# EAGLE design BreakoutShieldRevB (EAGLE 7.5.0)
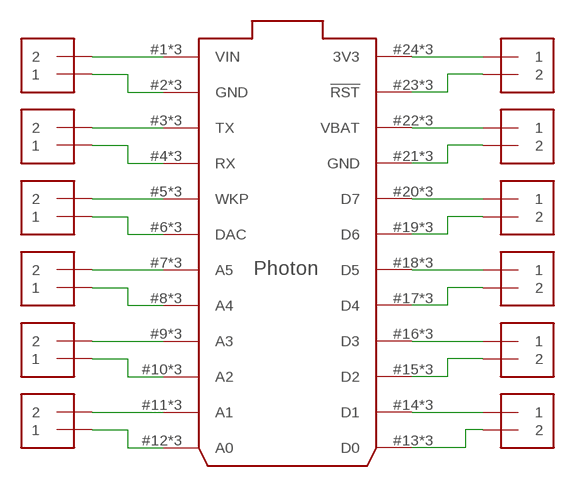
[diagram p0: schematic, sheet 1]

## Parts
J1  1X2-3.5MM  [1X2-3.5MM]
J2  1X2-3.5MM  [1X2-3.5MM]
J3  1X2-3.5MM  [1X2-3.5MM]
J4  1X2-3.5MM  [1X2-3.5MM]
J5  1X2-3.5MM  [1X2-3.5MM]
J6  1X2-3.5MM  [1X2-3.5MM]
J7  1X2-3.5MM  [1X2-3.5MM]
J8  1X2-3.5MM  [1X2-3.5MM]
J9  1X2-3.5MM  [1X2-3.5MM]
J10  1X2-3.5MM  [1X2-3.5MM]
J11  1X2-3.5MM  [1X2-3.5MM]
J12  1X2-3.5MM  [1X2-3.5MM]
U$1  PHOTON_WITH_STACKABLE_HEADERS  [PHOTON_STACKABLE]

## Nets
N$1: J1.2 U$1.1(VIN) U$1.#1(VIN) U$1.@1(VIN)
N$2: J1.1 U$1.2(GND) U$1.#2(GND) U$1.@2(GND)
N$3: J2.2 U$1.3(TX) U$1.#3(TX) U$1.@3(TX)
N$4: J2.1 U$1.4(RX) U$1.#4(RX) U$1.@4(RX)
N$5: J3.2 U$1.5(WKP) U$1.#5(WKP) U$1.@5(WKP)
N$6: J3.1 U$1.6(DAC) U$1.#6(DAC) U$1.@6(DAC)
N$7: J4.2 U$1.7(A5) U$1.#7(A5) U$1.@7(A5)
N$8: J4.1 U$1.8(A4) U$1.#8(A4) U$1.@8(A4)
N$9: J5.2 U$1.9(A3) U$1.#9(A3) U$1.@9(A3)
N$10: J5.1 U$1.10(A2) U$1.#10(A2) U$1.@10(A2)
N$11: J6.2 U$1.11(A1) U$1.#11(A1) U$1.@11(A1)
N$12: J6.1 U$1.12(A0) U$1.#12(A0) U$1.@12(A0)
N$13: J7.1 U$1.24(3V3) U$1.#24(3V3) U$1.@24(3V3)
N$14: J7.2 U$1.23(!RST) U$1.#23(!RST) U$1.@23(!RST)
N$15: J8.1 U$1.22(VBAT) U$1.#22(VBAT) U$1.@22(VBAT)
N$16: J8.2 U$1.21(GND) U$1.#21(GND) U$1.@21(GND)
N$17: J9.1 U$1.20(D7) U$1.#20(D7) U$1.@20(D7)
N$18: J9.2 U$1.19(D6) U$1.#19(D6) U$1.@19(D6)
N$19: J10.1 U$1.18(D5) U$1.#18(D5) U$1.@18(D5)
N$20: J10.2 U$1.17(D4) U$1.#17(D4) U$1.@17(D4)
N$21: J11.1 U$1.16(D3) U$1.#16(D3) U$1.@16(D3)
N$22: J11.2 U$1.15(D2) U$1.#15(D2) U$1.@15(D2)
N$23: J12.1 U$1.14(D1) U$1.#14(D1) U$1.@14(D1)
N$24: J12.2 U$1.13(D0) U$1.#13(D0) U$1.@13(D0)

## Library data of the parts
J1-J12 = adafruit:1X2: 3.5mm Terminal block http://www.ladyada.net/library/pcb/eaglelibrary.html
U$1 = Spark:PHOTON

## Board
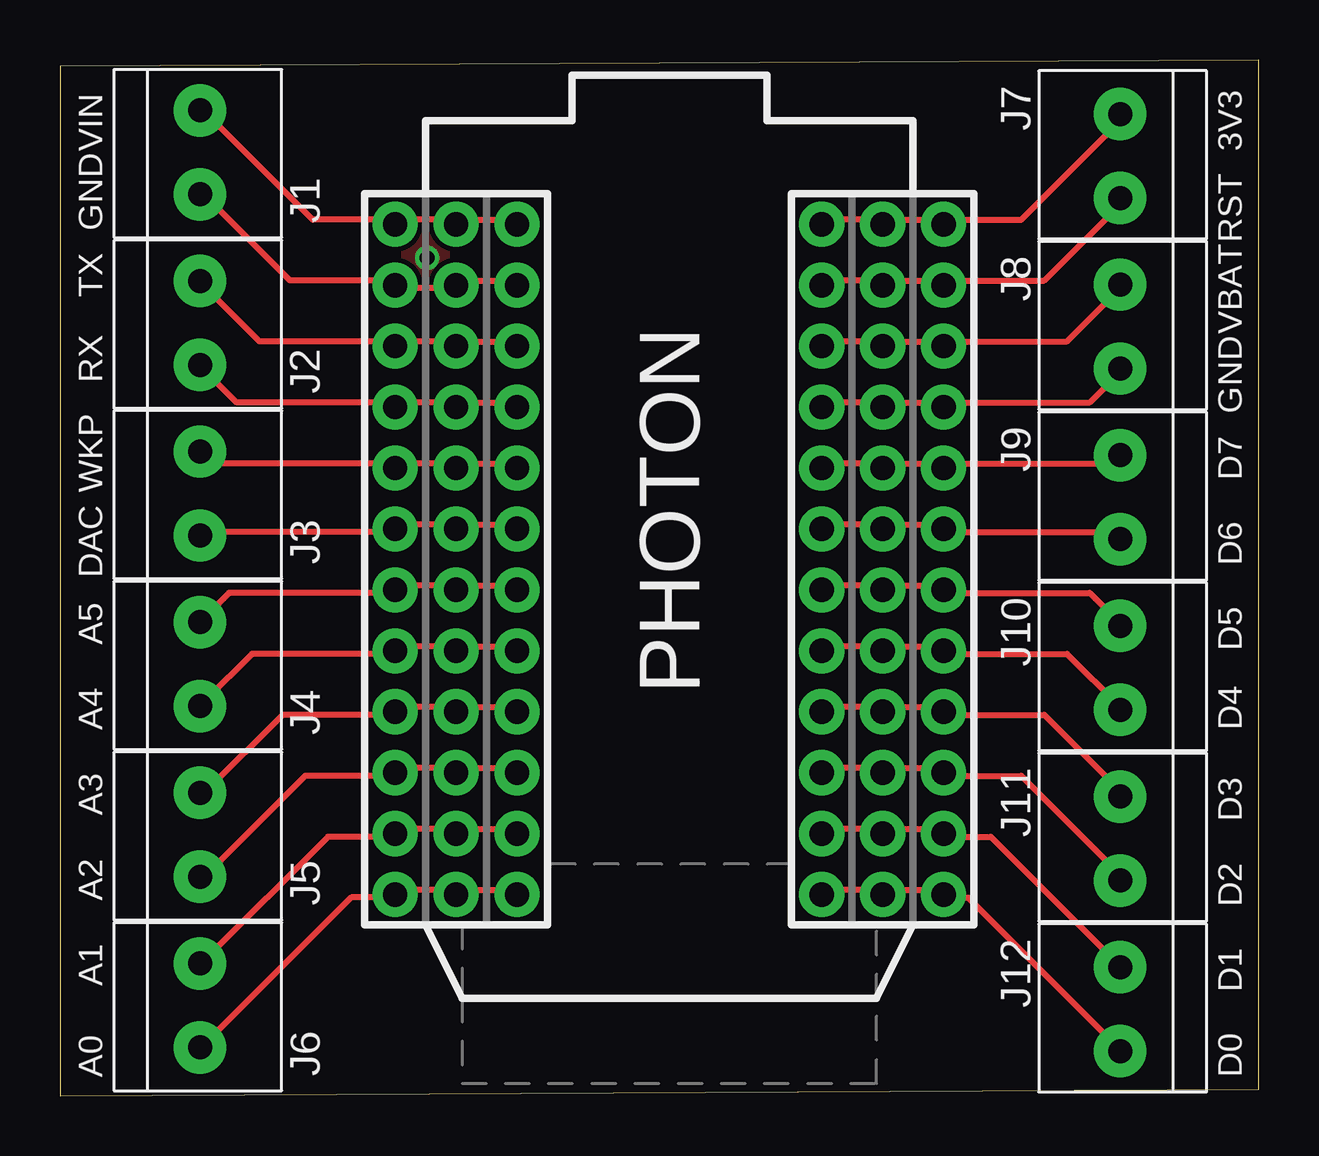
[diagram p1: board, top side]
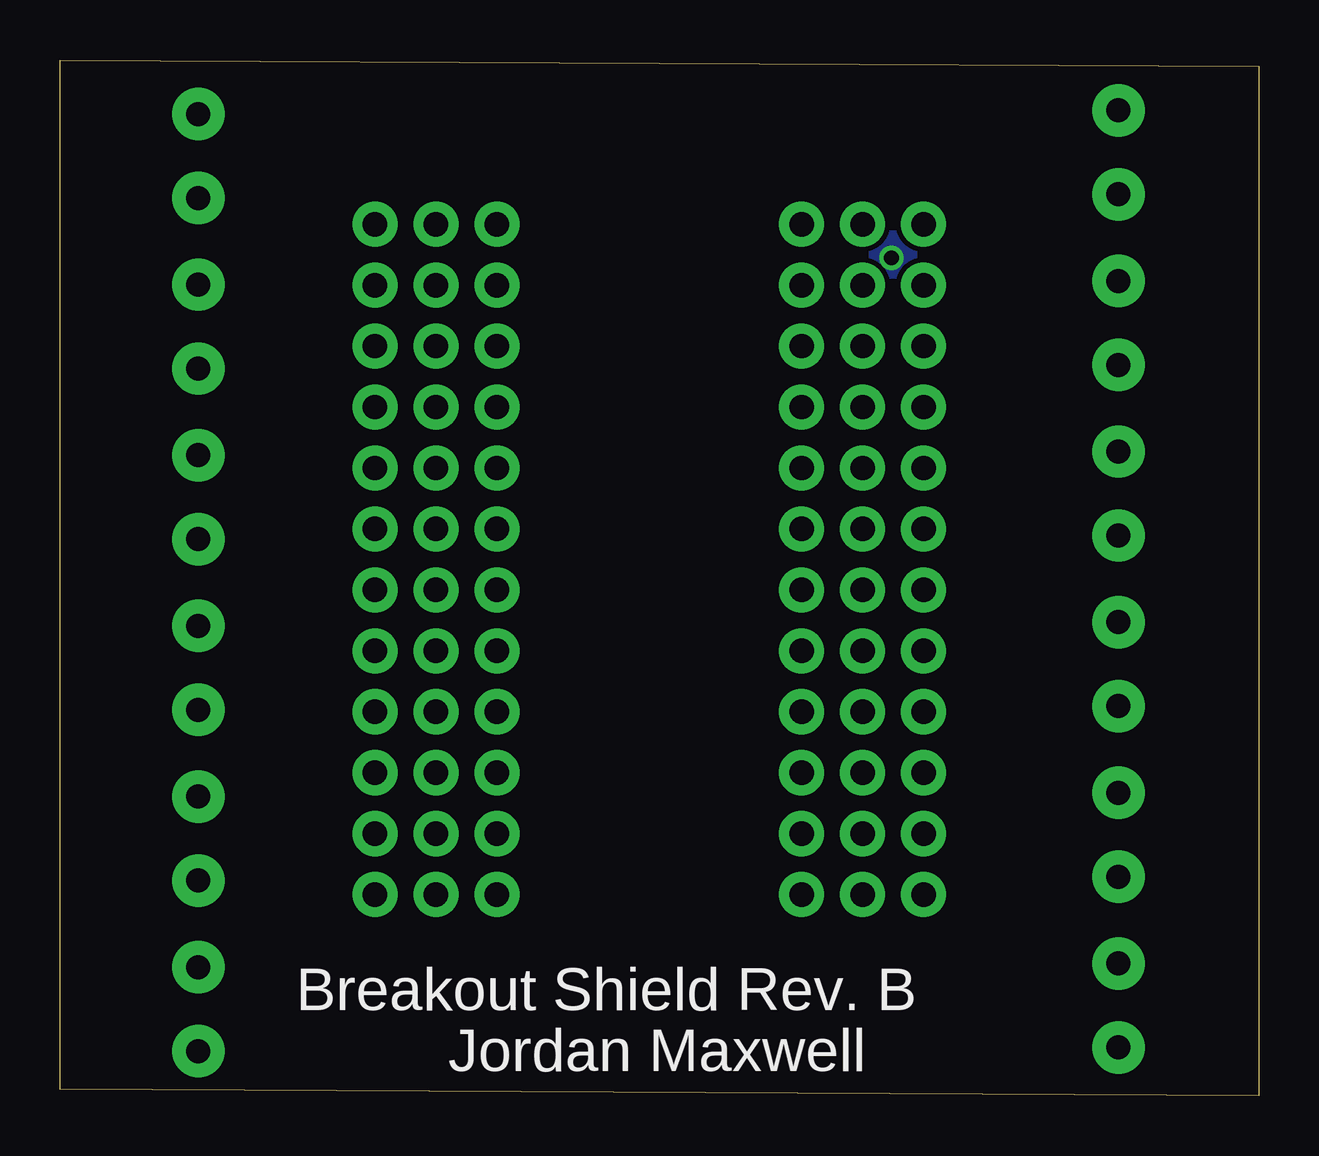
[diagram p2: board, bottom side, seen from below]

Size 49.96 x 43.17 mm. Coordinates in mm from the lower left corner, seen from the top.
Outline: 0,0 49.96,0.25 49.96,43.17 0,42.92 0,0
Copper layers (1*16): Top 0.035mm / dielectric 1.5mm / Bottom 0.035mm
Design rules "default": minimum track width 10mil, minimum drill 24mil, track to track 8mil, track to pad 8mil, pad to pad 8mil, via to via 8mil, smd to smd 8mil, copper to edge 40mil, drill to drill 8mil, minimum pad ring 10mil, minimum via ring 8mil, stop-mask expansion 4mil, vias tented up to drill 0mil, thermal gap 10mil

### Footprints (pad centres in the part's own frame; a part is rotated, then mirrored left to right if it is on the bottom)
1X2-3.5MM = drill 1 pad 2.184: 1 1.8,0; 2 -1.7,0
PHOTON_STACKABLE = drill 1.016 pad 1.88: 1 1.27,32.258; 2 1.27,29.718; 3 1.27,27.178; 4 1.27,24.638; 5 1.27,22.098; 6 1.27,19.558; 7 1.27,17.018; 8 1.27,14.478; 9 1.27,11.938; 10 1.27,9.398; 11 1.27,6.858; 12 1.27,4.318; 13 19.05,4.318; 14 19.05,6.858; 15 19.05,9.398; 16 19.05,11.938; 17 19.05,14.478; 18 19.05,17.018; 19 19.05,19.558; 20 19.05,22.098; 21 19.05,24.638; 22 19.05,27.178; 23 19.05,29.718; 24 19.05,32.258; #1 3.81,32.258; #2 3.81,29.718; #3 3.81,27.178; #4 3.81,24.638; #5 3.81,22.098; #6 3.81,19.558; #7 3.81,17.018; #8 3.81,14.478; #9 3.81,11.938; #10 3.81,9.398; #11 3.81,6.858; #12 3.81,4.318; #13 21.59,4.318; #14 21.59,6.858; #15 21.59,9.398; #16 21.59,11.938; #17 21.59,14.478; #18 21.59,17.018; #19 21.59,19.558; #20 21.59,22.098; #21 21.59,24.638; #22 21.59,27.178; #23 21.59,29.718; #24 21.59,32.258; @1 -1.27,32.258; @2 -1.27,29.718; @3 -1.27,27.178; @4 -1.27,24.638; @5 -1.27,22.098; @6 -1.27,19.558; @7 -1.27,17.018; @8 -1.27,14.478; @9 -1.27,11.938; @10 -1.27,9.398; @11 -1.27,6.858; @12 -1.27,4.318; @13 16.51,4.318; @14 16.51,6.858; @15 16.51,9.398; @16 16.51,11.938; @17 16.51,14.478; @18 16.51,17.018; @19 16.51,19.558; @20 16.51,22.098; @21 16.51,24.638; @22 16.51,27.178; @23 16.51,29.718; @24 16.51,32.258

### Placement (x,y rotation side)
J1  5.84,39.37 270 top
J2  5.84,32.26 270 top
J3  5.84,25.15 270 top
J4  5.84,18.03 270 top
J5  5.84,10.92 270 top
J6  5.84,3.81 270 top
J7  44.2,39.12 90 top
J8  44.2,32 90 top
J9  44.2,24.89 90 top
J10  44.2,17.78 90 top
J11  44.2,10.67 90 top
J12  44.2,3.56 90 top
U$1  15.24,4.06 0 top

### Tracks (layer width: path | path; a pad name or v marks a point on that pad's centre or on a via)
GND  (via drill 0.61)
  other vias: 15.3,34.93
  pour Bottom: 0,-0.25 50.04,0 50.04,42.93 0,42.67
  pour Top: 0,-0.25 50.04,0 50.04,42.93 0,42.67
N$1
  Top 0.254: U$1.#1 18.8,36.51 16.57,36.51 U$1.1 16.26,36.51 14.03,36.51 U$1.@1 13.72,36.51 10.54,36.51 6.1,40.96 J1.2
N$2
  Top 0.254: U$1.#2 18.8,33.97 16.57,33.97 U$1.2 16.26,33.66 14.03,33.66 U$1.@2 13.72,33.97 9.59,33.97 6.1,37.47 J1.1
N$3
  Top 0.254: U$1.#3 18.8,31.43 16.57,31.43 U$1.3 16.26,31.43 14.03,31.43 U$1.@3 13.72,31.43 8.32,31.43 6.1,33.66 J2.2
N$4
  Top 0.254: U$1.#4 18.8,28.89 16.57,28.89 U$1.4 16.26,28.89 14.03,28.89 U$1.@4 13.72,28.89 7.37,28.89 6.1,30.16 J2.1
N$5
  Top 0.254: U$1.#5 18.8,26.35 16.57,26.35 U$1.5 16.26,26.35 14.03,26.35 U$1.@5 13.72,26.35 6.41,26.35 6.1,26.67 J3.2
N$6
  Top 0.254: U$1.#6 18.8,23.81 16.57,23.81 U$1.6 16.26,23.81 14.03,23.81 U$1.@6 13.72,23.49 6.1,23.49 J3.1
N$7
  Top 0.254: U$1.#7 18.8,21.27 16.57,21.27 U$1.7 16.26,21.27 14.03,21.27 U$1.@7 13.72,20.95 7.05,20.95 6.1,20 J4.2
N$8
  Top 0.254: U$1.#8 18.8,18.73 16.57,18.73 U$1.8 16.26,18.73 14.03,18.73 U$1.@8 13.72,18.41 8,18.41 6.1,16.51 J4.1
N$9
  Top 0.254: U$1.#9 18.8,16.19 16.57,16.19 U$1.9 16.26,16.19 14.03,16.19 U$1.@9 13.72,15.88 9.27,15.88 6.1,12.7 J5.2
N$10
  Top 0.254: U$1.#10 18.8,13.65 16.57,13.65 U$1.10 16.26,13.65 14.03,13.65 U$1.@10 13.72,13.34 10.22,13.34 6.1,9.21 J5.1
N$11
  Top 0.254: U$1.#11 18.8,11.11 16.57,11.11 U$1.11 16.26,11.11 14.03,11.11 U$1.@11 13.72,10.79 11.18,10.79 6.1,5.71 J6.2
N$12
  Top 0.254: U$1.#12 18.8,8.57 16.57,8.57 U$1.12 16.26,8.57 14.03,8.57 U$1.@12 13.72,8.26 12.13,8.26 6.1,2.22 J6.1
N$13
  Top 0.254: U$1.@24 31.81,36.51 34.04,36.51 U$1.24 34.35,36.51 36.58,36.51 U$1.#24 36.89,36.51 40.07,36.51 44.2,40.64 J7.1
N$14
  Top 0.254: U$1.@23 31.81,33.97 34.04,33.97 U$1.23 34.35,33.97 36.58,33.97 U$1.#23 36.89,33.97 41.02,33.97 44.2,37.15 J7.2
N$15
  Top 0.254: U$1.@22 31.81,31.43 34.04,31.43 U$1.22 34.35,31.43 36.58,31.43 U$1.#22 36.89,31.43 41.97,31.43 44.2,33.66 J8.1
N$16
  Top 0.254: U$1.@21 31.81,28.89 34.04,28.89 U$1.21 34.35,28.89 36.58,28.89 U$1.#21 36.89,28.89 42.93,28.89 44.2,30.16 J8.2
N$17
  Top 0.254: U$1.@20 31.81,26.35 34.04,26.35 U$1.20 34.35,26.35 36.58,26.35 U$1.#20 36.89,26.35 43.88,26.35 44.2,26.67 J9.1
N$18
  Top 0.254: U$1.@19 31.81,23.81 34.04,23.81 U$1.19 34.35,23.81 36.58,23.81 U$1.#19 36.89,23.49 44.2,23.49 J9.2
N$19
  Top 0.254: U$1.@18 31.81,21.27 34.04,21.27 U$1.18 34.35,21.27 36.58,21.27 U$1.#18 36.89,20.95 42.93,20.95 44.2,19.68 J10.1
N$20
  Top 0.254: U$1.@17 31.81,18.73 34.04,18.73 U$1.17 34.35,18.73 36.58,18.73 U$1.#17 36.89,18.41 41.97,18.41 44.2,16.19 J10.2
N$21
  Top 0.254: U$1.@16 31.81,16.19 34.04,16.19 U$1.16 34.35,16.19 36.58,16.19 U$1.#16 36.89,15.88 41.02,15.88 44.2,12.7 J11.1
N$22
  Top 0.254: U$1.@15 31.81,13.65 34.04,13.65 U$1.15 34.35,13.65 36.58,13.65 U$1.#15 36.89,13.34 40.07,13.34 44.2,9.21 J11.2
N$23
  Top 0.254: U$1.@14 31.81,11.11 34.04,11.11 U$1.14 34.35,11.11 36.58,11.11 U$1.#14 36.89,10.79 38.8,10.79 44.2,5.4 J12.1
N$24
  Top 0.254: U$1.@13 31.81,8.57 34.04,8.57 U$1.13 34.35,8.57 36.58,8.57 U$1.#13 36.89,8.26 37.85,8.26 44.2,1.9 J12.2

### Text on the board
tPlace: VIN | 3V3 | GND | RST | TX | VBAT | RX | GND | D7 | WKP | DAC | D6 | A5 | D5 | PHOTON | A4 | D4 | A3 | D3 | A2 | D2 | A1 | D1 | A0 | D0
bPlace: Breakout Shield Rev. B | Jordan Maxwell